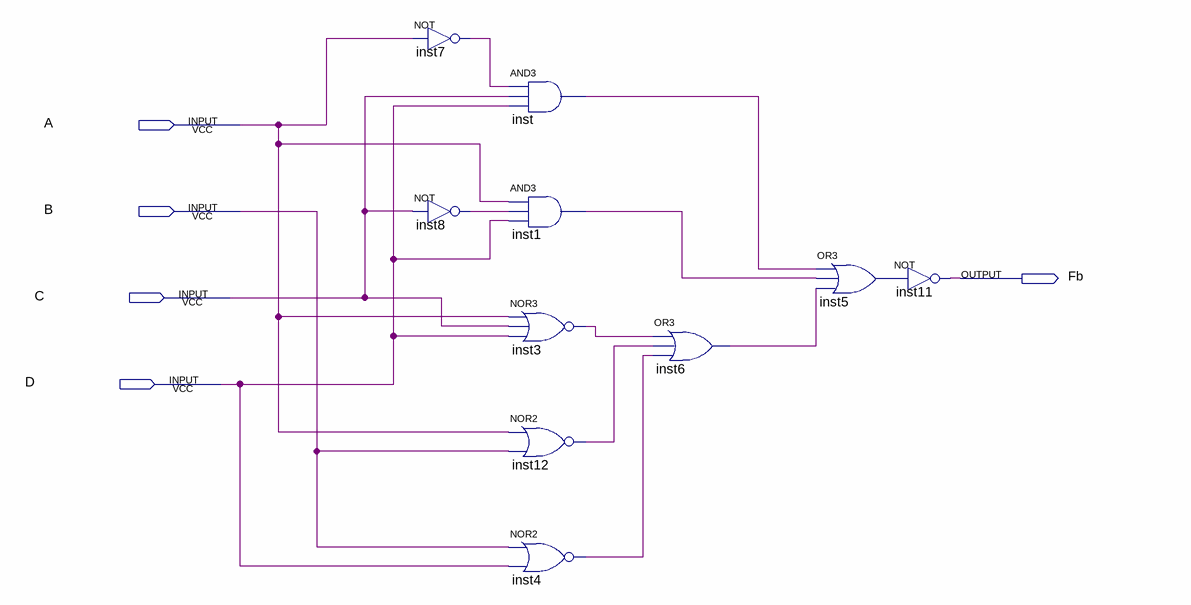
[diagram p0: schematic sheet]
// Quartus schematic fb.bdf as structural Verilog: 10 symbols, 5 pins
module fb (
  input  A,
  input  B,
  input  C,
  input  D,
  output Fb
);

  wire inst1_out, inst3_out, inst4_out, inst5_out, inst6_out, inst7_out, inst8_out, inst12_out, inst_out;

  not inst7 (inst7_out, A);
  not inst8 (inst8_out, C);
  and inst (inst_out, inst7_out, C, D);
  and inst1 (inst1_out, A, inst8_out, D);
  nor inst3 (inst3_out, A, C, D);
  nor inst12 (inst12_out, A, B);
  nor inst4 (inst4_out, B, D);
  or inst6 (inst6_out, inst3_out, inst12_out, inst4_out);
  or inst5 (inst5_out, inst_out, inst1_out, inst6_out);
  not inst11 (Fb, inst5_out);
endmodule
